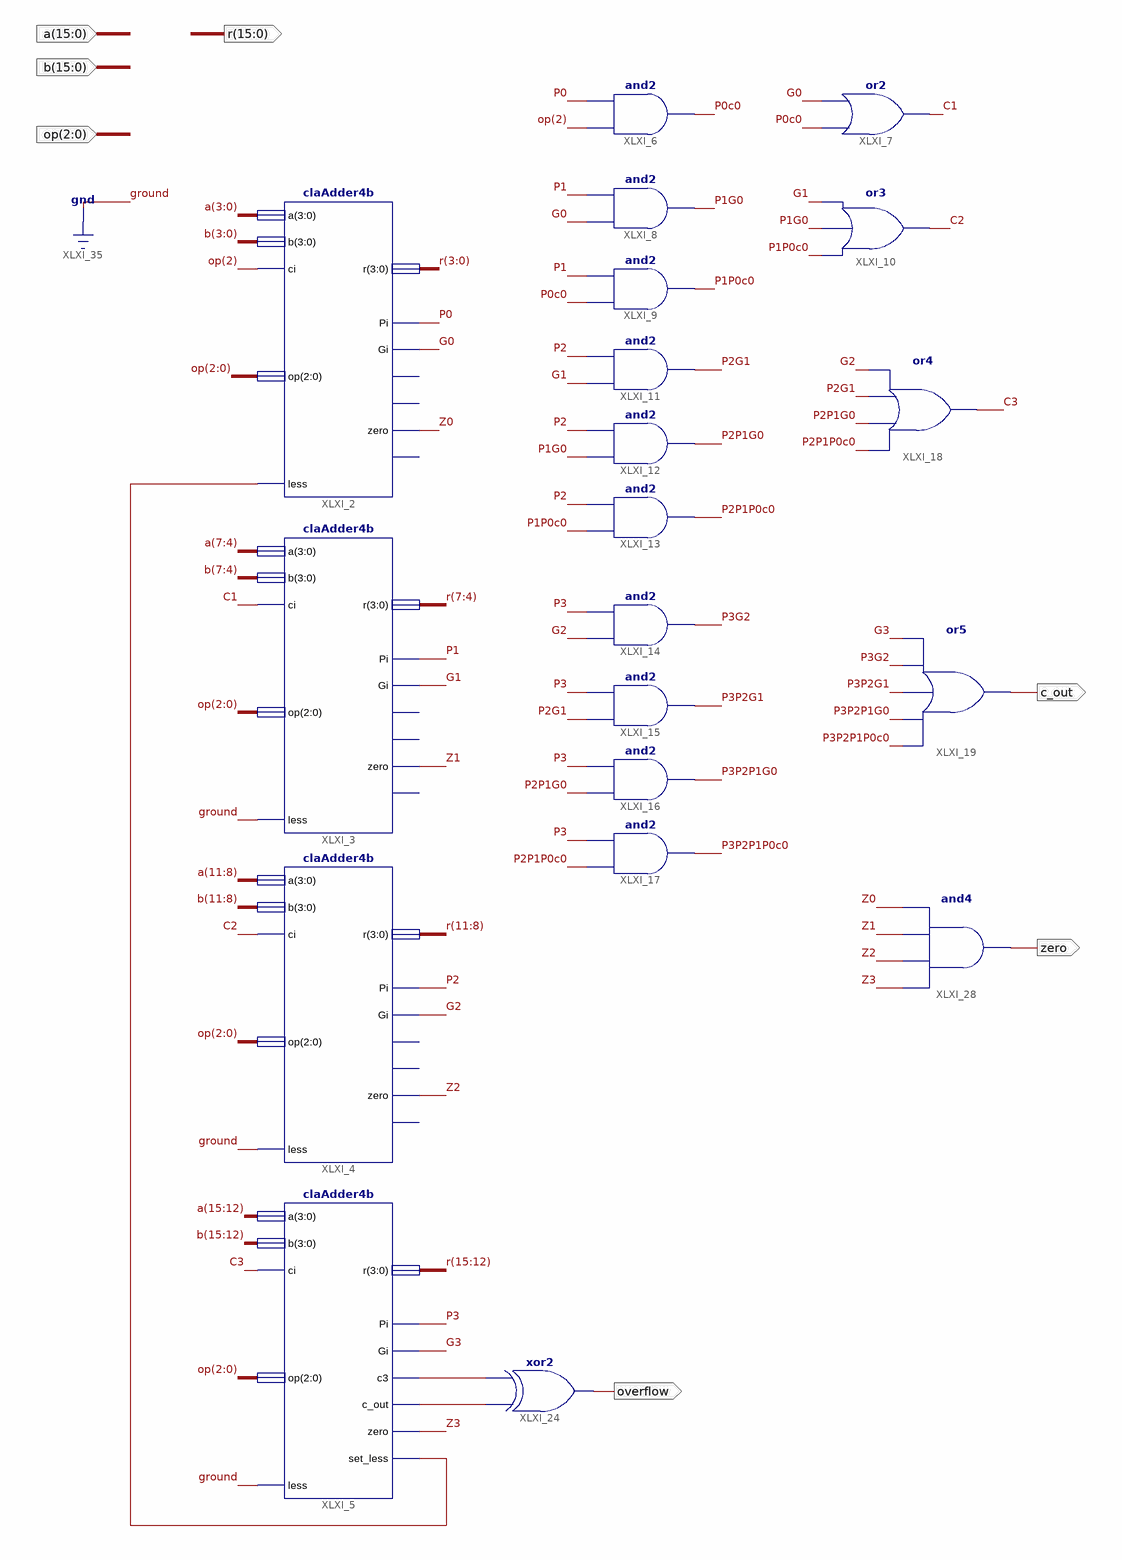
[diagram p0: schematic sheet 1]
// Xilinx ISE schematic claAdde16b.sch (spartan3e) as structural Verilog: 20 symbols, 7 ports
module claAdde16b (
  input  [15:0] a,
  input  [15:0] b,
  input  [2:0] op,
  output c_out,
  output [15:0] r,
  output zero,
  output overflow
);

  wire C1, C2, C3, G0, G1, G2, G3, P0, P0c0, P1, P1G0, P1P0c0, P2, P2G1, P2P1G0, P2P1P0c0, P3, P3G2, P3P2G1,
       P3P2P1G0, P3P2P1P0c0, XLXN_29, XLXN_30, XLXN_81, Z0, Z1, Z2, Z3;

  and XLXI_6 (P0c0, op[2], P0);
  or XLXI_7 (C1, P0c0, G0);
  and XLXI_8 (P1G0, G0, P1);
  and XLXI_9 (P1P0c0, P0c0, P1);
  or XLXI_10 (C2, P1P0c0, P1G0, G1);
  and XLXI_11 (P2G1, G1, P2);
  and XLXI_12 (P2P1G0, P1G0, P2);
  and XLXI_13 (P2P1P0c0, P1P0c0, P2);
  and XLXI_14 (P3G2, G2, P3);
  and XLXI_15 (P3P2G1, P2G1, P3);
  and XLXI_16 (P3P2P1G0, P2P1G0, P3);
  and XLXI_17 (P3P2P1P0c0, P2P1P0c0, P3);
  or XLXI_18 (C3, P2P1P0c0, P2P1G0, P2G1, G2);
  or XLXI_19 (c_out, P3P2P1P0c0, P3P2P1G0, P3P2G1, P3G2, G3);
  and XLXI_28 (zero, Z3, Z2, Z1, Z0);
  claAdder4b XLXI_2 (
    .a(a[3:0]), .b(b[3:0]), .ci(op[2]), .op(op), .less(XLXN_81), .Pi(P0), .Gi(G0), .r(r[3:0]), .zero(Z0));  // open: c3, c_out, set_less
  claAdder4b XLXI_3 (
    .a(a[7:4]), .b(b[7:4]), .ci(C1), .op(op), .less(1'b0), .Pi(P1), .Gi(G1), .r(r[7:4]), .zero(Z1));  // open: c3, c_out, set_less
  claAdder4b XLXI_4 (
    .a(a[11:8]), .b(b[11:8]), .ci(C2), .op(op), .less(1'b0), .Pi(P2), .Gi(G2), .r(r[11:8]), .zero(Z2));  // open: c3, c_out, set_less
  claAdder4b XLXI_5 (
    .a(a[15:12]), .b(b[15:12]), .ci(C3), .op(op), .less(1'b0), .c3(XLXN_29), .Pi(P3), .Gi(G3), .r(r[15:12]),
    .c_out(XLXN_30), .zero(Z3), .set_less(XLXN_81));
  xor XLXI_24 (overflow, XLXN_30, XLXN_29);
endmodule
